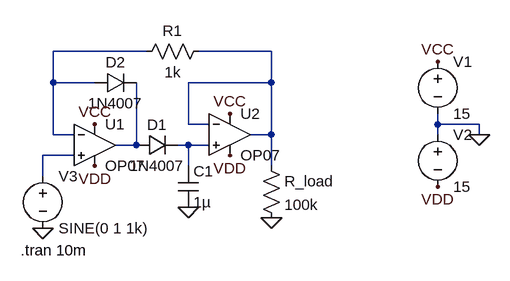
[diagram p0: schematic Peak Detector.asc]
Peak Detector.asc, the LTspice schematic file:
Version 4
SHEET 1 880 680
WIRE 192 32 48 32
WIRE 384 32 272 32
WIRE 48 80 48 32
WIRE 112 80 48 80
WIRE 384 80 384 32
WIRE 384 80 256 80
WIRE 256 144 256 80
WIRE 288 144 256 144
WIRE 640 144 640 128
WIRE 704 144 640 144
WIRE 48 160 48 80
WIRE 80 160 48 160
WIRE 384 160 384 80
WIRE 384 160 352 160
WIRE 640 160 640 144
WIRE 704 160 704 144
WIRE 176 176 176 80
WIRE 176 176 144 176
WIRE 256 176 240 176
WIRE 288 176 256 176
WIRE 80 192 32 192
WIRE 256 208 256 176
WIRE 384 208 384 160
WIRE 32 224 32 192
FLAG 704 160 0
FLAG 640 48 VCC
FLAG 320 128 VCC
FLAG 112 144 VCC
FLAG 640 240 VDD
FLAG 320 192 VDD
FLAG 112 208 VDD
FLAG 256 272 0
FLAG 32 304 0
FLAG 384 288 0
SYMBOL OpAmps\\OP07 112 112 R0
SYMATTR InstName U1
SYMBOL OpAmps\\OP07 320 96 R0
SYMATTR InstName U2
SYMBOL voltage 640 32 R0
WINDOW 123 0 0 Left 0
WINDOW 39 0 0 Left 0
SYMATTR InstName V1
SYMATTR Value 15
SYMBOL voltage 640 144 R0
WINDOW 123 0 0 Left 0
WINDOW 39 0 0 Left 0
SYMATTR InstName V2
SYMATTR Value 15
SYMBOL diode 176 192 R270
WINDOW 0 32 32 VTop 2
WINDOW 3 0 32 VBottom 2
SYMATTR InstName D1
SYMATTR Value 1N4007
SYMBOL cap 240 208 R0
SYMATTR InstName C1
SYMATTR Value 1µ
SYMBOL diode 112 96 R270
WINDOW 0 32 32 VTop 2
WINDOW 3 0 32 VBottom 2
SYMATTR InstName D2
SYMATTR Value 1N4007
SYMBOL res 288 16 R90
WINDOW 0 0 56 VBottom 2
WINDOW 3 32 56 VTop 2
SYMATTR InstName R1
SYMATTR Value 1k
SYMBOL voltage 32 208 R0
WINDOW 123 0 0 Left 0
WINDOW 39 0 0 Left 0
SYMATTR InstName V3
SYMATTR Value SINE(0 1 1k)
SYMBOL res 368 192 R0
SYMATTR InstName R_load
SYMATTR Value 100k
TEXT -2 338 Left 2 !.tran 10m

The netlist it stands for:
* Peak Detector.asc
XU1 N005 N001 VCC VDD N003 LT1001  ; OP07, pins In+ In- V+ V- OUT
XU2 N004 N002 VCC VDD N002 LT1001  ; OP07, pins In+ In- V+ V- OUT
V1 VCC 0 15
V2 0 VDD 15
D1 N003 N004 1N4007
C1 N004 0 1µ
D2 N001 N003 1N4007
R1 N002 N001 1k
V3 N005 0 SINE(0 1 1k)
R_load N002 0 100k
.model D D
.lib standard.dio
.tran 10m
.lib LTC.lib
.backanno
.end